# Altium schematic sheet A_INPUT.SchDoc
size A3; Date: *******; ApprovedBy: *******; CheckedBy: None; Author: *******; CompanyName: *******; DrawnBy: V.HIEU; Engineer: *******; Organization: *******; Address2: *******; Address3: *******; Address4: *******; DocumentNumber: Doc Num; Revision: V1.0; Email: truongvanhieu17102005@gmail.com; CurrentTime: *******; CurrentDate: *******; Time: *******; DocumentFullPathAndName: *******; DocumentName: *******; ModifiedDate: *******; ImagePath: *******; ProjectName: *******; Application_BuildNumber: *******
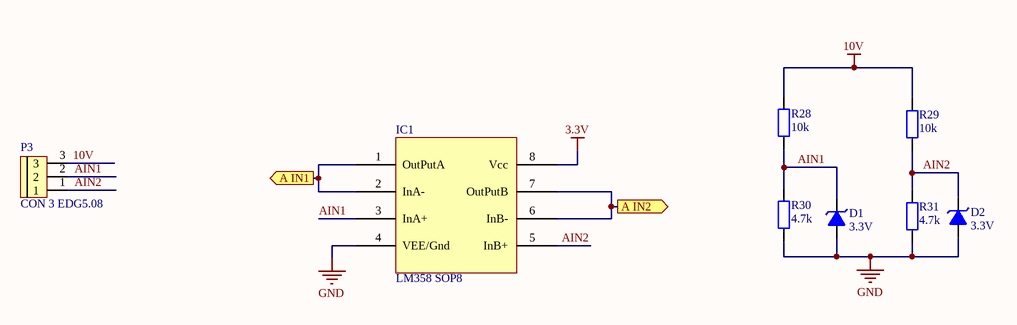
[diagram p0: A_INPUT.SchDoc]

## Parts
D1  3.3V  [DIODE ZENNER SMD SOD80]
D2  3.3V  [DIODE ZENNER SMD SOD80]
IC1  LM358 SOP8  [SOP 8]
P3  CON 3 EDG5.08  [CON 3 3EDG5.08]
R28  10k  [tro smd 0805]
R29  10k  [tro smd 0805]
R30  4.7k  [tro smd 0805]
R31  4.7k  [tro smd 0805]

## Ports
A IN1 (out), A IN2 (out)

## Nets
3.3V: IC1.8(Vcc)
10V: P3.3 R28.2 R29.2
GND: D1.1(A) D2.1(A) IC1.4(VEE/Gnd) R30.1 R31.1
A IN1: IC1.1(OutPutA) IC1.2(InA-) ; port A IN1
A IN2: IC1.6(InB-) IC1.7(OutPutB) ; port A IN2
AIN1: D1.2(K) IC1.3(InA+) P3.2 R28.1 R30.2
AIN2: D2.2(K) IC1.5(InB+) P3.1 R29.1 R31.2

## Notes on the sheet
- Title:
- Size:
- Drawn By:
- Page Contents:
- A3
- Number:
- Checked By:
- Revision:
- Date:
- File:
- License:
- Email:
- Time:
- Sheet
- Website:
- of

## Library data of the parts
D1 D2 = Diode Zener 3.3V: Dán; Don_Vi: Con; Ma_Hang: MH002880; Ten_Linh_Kien: Diode Zener 1/2W 3.3V SMD1206 ZMM3.3; Kieu_Chan: *; Ghi_Chu: *; Chung_Loai: Dán
IC1 = LM358 SOP8: Dán; Ma_Hang: MH000609; Don_Vi: Con; Ten_Linh_Kien: LM358 SOP8; Kieu_Chan: *; Ghi_Chu: *; Chung_Loai: Dán
P3 = CON 3 EDG5.08: Cắm; Ten_Linh_Kien: CON 3 2EDG5.08-3P 5.08MM ( Xanh Cong); Ma_Hang: MH000760; Ghi_Chu: *; Kieu_Chan: *; Don_Vi: Con; Chung_Loai: Cắm
R28 R29 = Tro 0805 5% 10k: Dán; Don_Vi: Con; So_Chan: 2; Ten_Linh_Kien: Trở 0805 5% 10k; Ma_Hang: MH005239; Chung_Loai: Dán; Kieu_Chan: *
R30 R31 = Tro 0805 5% 4.7k: Dán; Don_Vi: Con; So_Chan: 2; Ten_Linh_Kien: Trở 0805 5% 4.7k; Ma_Hang: MH005307; Chung_Loai: Dán; Kieu_Chan: *